# EAGLE schematic dac_ (EAGLE 9.0.1)
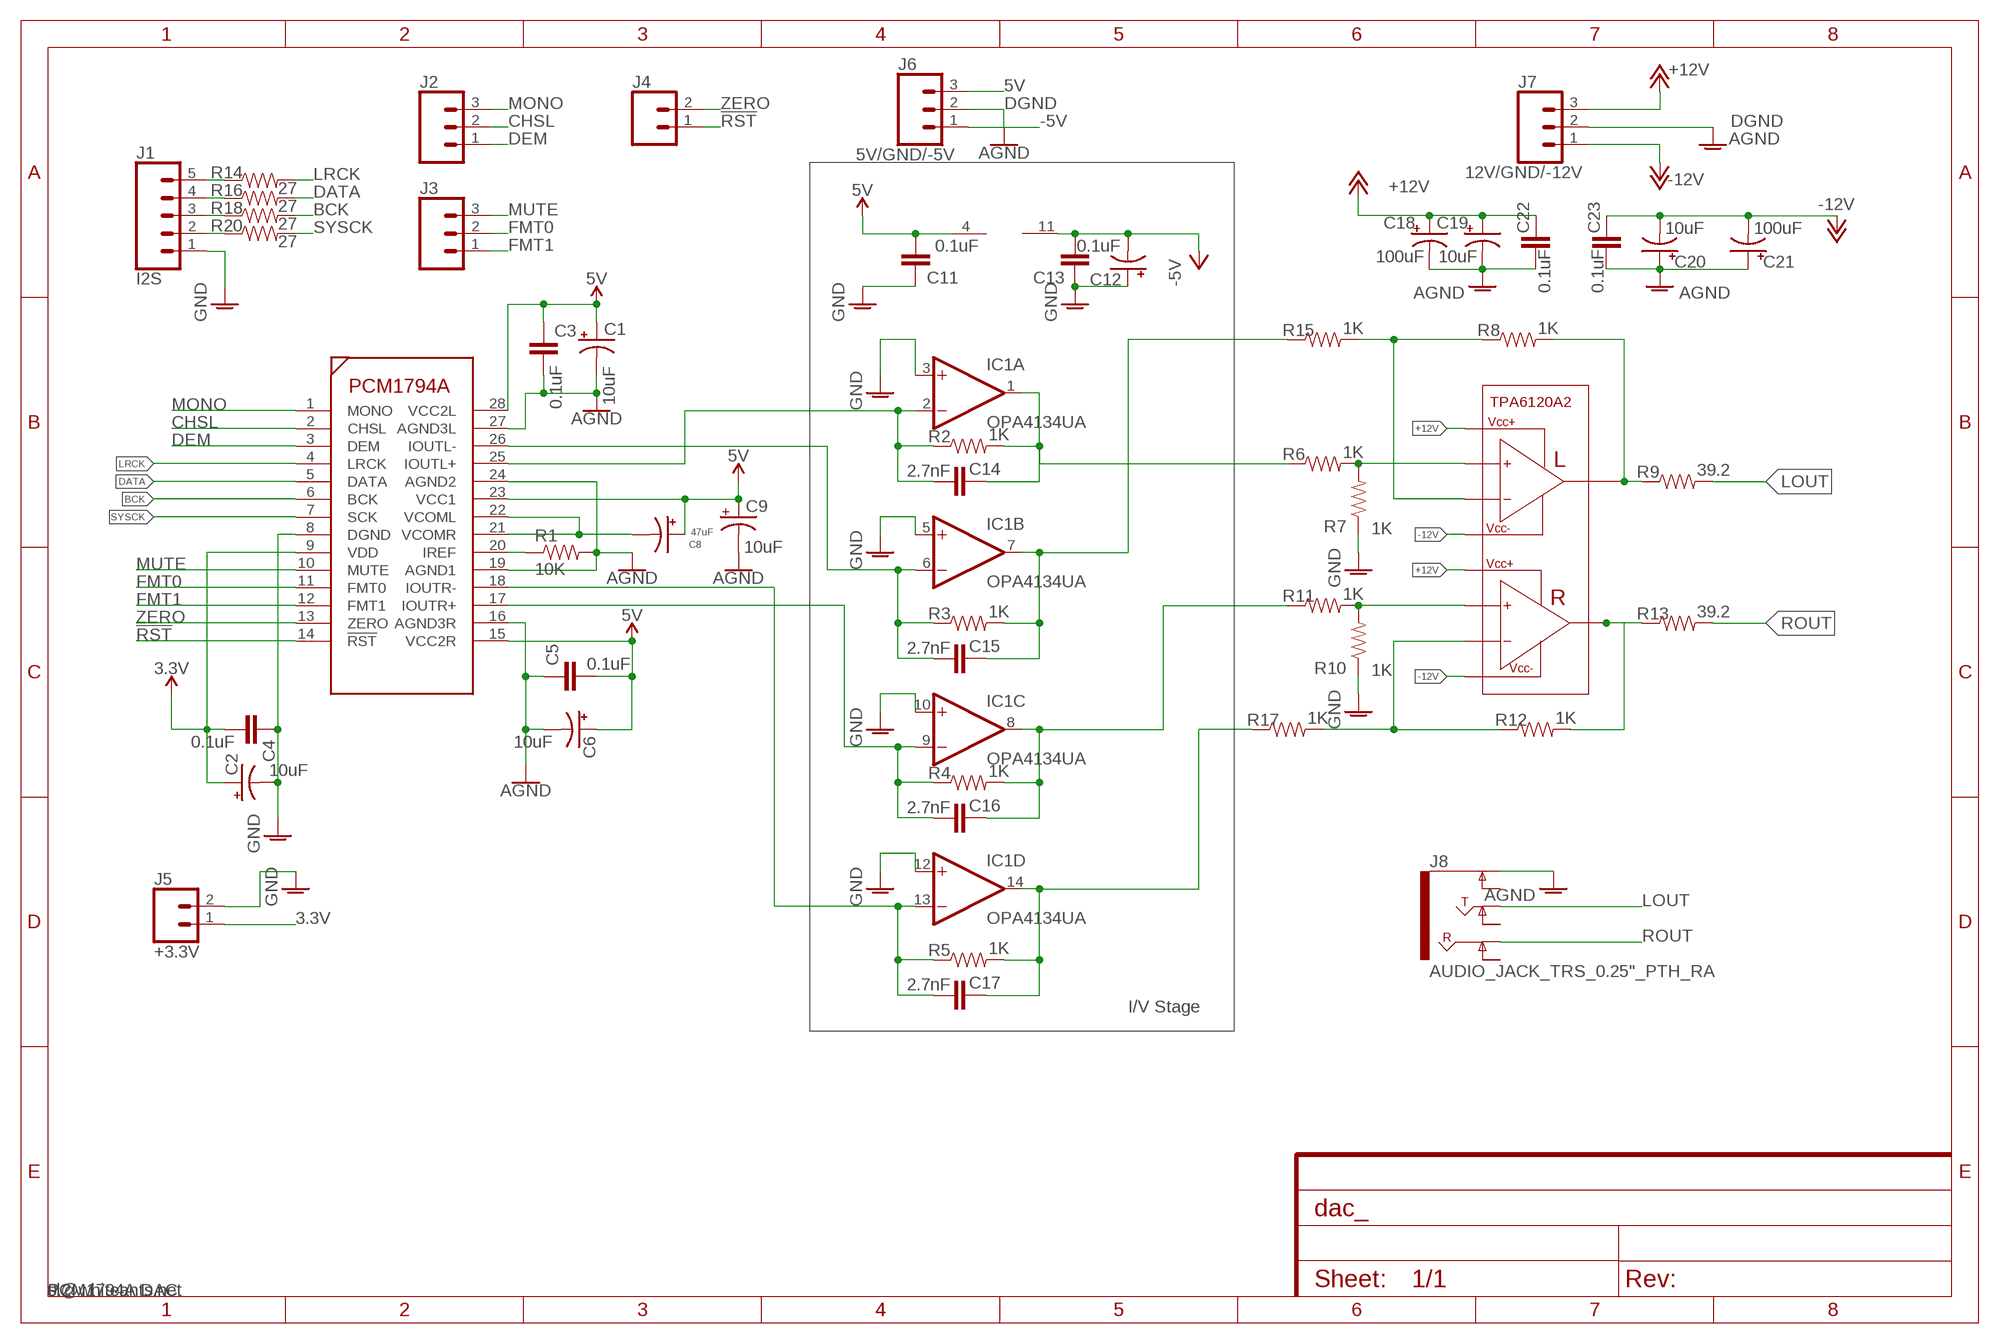
[diagram p0: schematic, sheet 1]
FRAME1 (FRAME-A4L): CNAME: PCM1794A DAC; CREVISION: 0.2; DESIGNER: sl@whiteants.net

## Parts
C1  10uF  CAP_POLPTH1  [CPOL-RADIAL-100UF-25V]
C2  10uF  CAP_POLPTH1  [CPOL-RADIAL-100UF-25V]
C3  0.1uF  CAP1206  [1206]
C4  0.1uF  CAP1206  [1206]
C5  0.1uF  CAP1206  [1206]
C6  10uF  CAP_POLPTH1  [CPOL-RADIAL-100UF-25V]
C8  47uF  CAP_POLPTH1  [CPOL-RADIAL-100UF-25V]
C9  10uF  CAP_POLPTH1  [CPOL-RADIAL-100UF-25V]
C11  0.1uF  CAP1206  [1206]
C12  10uF  CAP_POLPTH1  [CPOL-RADIAL-100UF-25V]
C13  0.1uF  CAP1206  [1206]
C14  2.7nF  CAP1206  [1206]
C15  2.7nF  CAP1206  [1206]
C16  2.7nF  CAP1206  [1206]
C17  2.7nF  CAP1206  [1206]
C18  100uF  CAP_POLPTH1  [CPOL-RADIAL-100UF-25V]
C19  10uF  CAP_POLPTH1  [CPOL-RADIAL-100UF-25V]
C20  10uF  CAP_POLPTH1  [CPOL-RADIAL-100UF-25V]
C21  100uF  CAP_POLPTH1  [CPOL-RADIAL-100UF-25V]
C22  0.1uF  CAP1206  [1206]
C23  0.1uF  CAP1206  [1206]
IC1  OPA4134UA  [SO14]
J1  I2S  CONN_05  [1X05]
J2  CONN_03POLAR  [MOLEX-1X3]
J3  CONN_03POLAR  [MOLEX-1X3]
J4  CONN_02POLAR_LOCK  [MOLEX-1X2_LOCK]
J5  +3.3V  CONN_02POLAR  [MOLEX-1X2]
J6  5V/GND/-5V  CONN_03LONGPADS  [1X03_LONGPADS]
J7  12V/GND/-12V  CONN_03LONGPADS  [1X03_LONGPADS]
J8  AUDIO_JACK_TRS_0.25"_PTH_RA  [AUDIO_JACK_0.25"_TRS_PTH_RA]
R1  10K  RESISTOR0805-RES  [0805]
R2  1K  RESISTOR0805-RES  [0805]
R3  1K  RESISTOR0805-RES  [0805]
R4  1K  RESISTOR0805-RES  [0805]
R5  1K  RESISTOR0805-RES  [0805]
R6  1K  RESISTOR0805-RES  [0805]
R7  1K  RESISTOR0805-RES  [0805]
R8  1K  RESISTOR0805-RES  [0805]
R9  39.2  RESISTOR0805-RES  [0805]
R10  1K  RESISTOR0805-RES  [0805]
R11  1K  RESISTOR0805-RES  [0805]
R12  1K  RESISTOR0805-RES  [0805]
R13  39.2  RESISTOR0805-RES  [0805]
R14  27  RESISTOR0805-RES  [0805]
R15  1K  RESISTOR0805-RES  [0805]
R16  27  RESISTOR0805-RES  [0805]
R17  1K  RESISTOR0805-RES  [0805]
R18  27  RESISTOR0805-RES  [0805]
R20  27  RESISTOR0805-RES  [0805]
UK1  PCM1794A  [SSOP28-0.65-10.2X5.2MM]
UK2  TPA6120A2  [SOIC20S]

## Nets
3.3V: C2.1(+) C4.2 J5.1 UK1.9(VDD)
5V: C1.1(+) C3.1 C5.2 C6.1(+) C8.1(+) C9.1(+) C11.2 IC1.4(P:V+) J6.3 UK1.15(VCC2R) UK1.23(VCC1) UK1.28(VCC2L)
!RST!: J4.1 UK1.14(!RST!)
+12V: C18.1(+) C19.1(+) C22.1 J7.3 UK2.3(LVCC+) UK2.18(RVCC+)
-5V: C12.2(-) C13.2 IC1.11(P:V-) J6.1
-12V: C20.2(-) C21.2(-) C23.1 J7.1 UK2.1(LVCC-) UK2.20(RVCC-)
BCK: R18.2 UK1.6(BCK)
CHSL: J2.2 UK1.2(CHSL)
DATA: R16.2 UK1.5(DATA)
DEM: J2.1 UK1.3(DEM)
DGND: C1.2(-) C2.2(-) C3.2 C4.1 C5.1 C6.2(-) C9.2(-) C11.1 C12.1(+) C13.1 C18.2(-) C19.2(-) C20.1(+) C21.1(+) C22.2 C23.2 IC1.3(A:+IN) IC1.5(B:+IN) IC1.10(C:+IN) IC1.12(D:+IN) J1.1 J5.2 J6.2 J7.2 J8.SLEEVE(EARTH) R1.2 R7.1 R10.1 UK1.8(DGND) UK1.16(AGND3R) UK1.19(AGND1) UK1.24(AGND2) UK1.27(AGND3L) ; supply symbol labelled GND, AGND
FMT0: J3.2 UK1.11(FMT0)
FMT1: J3.1 UK1.12(FMT1)
LOUT: J8.TIP R9.2
LRCK: R14.2 UK1.4(LRCK)
MONO: J2.3 UK1.1(MONO)
MUTE: J3.3 UK1.10(MUTE)
N$1: C15.2 IC1.6(B:-IN) R3.1 UK1.26(IOUTL-)
N$2: C14.2 IC1.2(A:-IN) R2.1 UK1.25(IOUTL+)
N$3: R1.1 UK1.20(IREF)
N$4: R6.2 R7.2 UK2.4(LIN+)
N$5: C14.1 IC1.1(A:OUT) R2.2 R6.1
N$6: C8.2(-) UK1.21(VCOMR) UK1.22(VCOML)
N$7: J1.5 R14.1
N$8: C15.1 IC1.7(B:OUT) R3.2 R15.1
N$9: R8.2 R9.1 UK2.2(LOUT)
N$10: R10.2 R11.2 UK2.17(RIN+)
N$11: R12.2 R13.1 UK2.19(ROUT)
N$12: C16.1 IC1.8(C:OUT) R4.2 R11.1
N$13: J1.4 R16.1
N$14: C16.2 IC1.9(C:-IN) R4.1 UK1.17(IOUTR+)
N$15: R8.1 R15.2 UK2.5(LIN-)
N$16: J1.3 R18.1
N$17: C17.2 IC1.13(D:-IN) R5.1 UK1.18(IOUTR-)
N$18: R12.1 R17.2 UK2.16(RIN-)
N$19: J1.2 R20.1
N$25: C17.1 IC1.14(D:OUT) R5.2 R17.1
ROUT: J8.RING R13.2
SYSCK: R20.2 UK1.7(SCK)
ZERO: J4.2 UK1.13(ZERO)
Unconnected: J8.RING-NORM J8.SLEEVE-NORM(EARTH-NORM) J8.TIP-NORM

## Notes on the sheet
- I/V Stage

## Library data of the parts
C1 C2 C6 C8 C9 C12 C18-C21 = SparkFun-Passives:CAP_POL: Capacitor Polarized These are standard SMD and PTH capacitors. Normally 10uF, 47uF, and 100uF in electrolytic and tantalum varieties. Always verify the external diameter of the through hole cap, it varies with capacity, voltage, and manufacturer. The EIA devices should be standard.
C3-C5 C11 C13-C17 C22 C23 = SparkFun-Passives:CAP: Capacitor Standard 0603 ceramic capacitor, and 0.1" leaded capacitor.
IC1 = linear:OPA4*: Quad Operational Amplifier compatible with: TLC27L4 Low Power, Single-Supply, Rail-To-Rail Operational Amplifier Source: http://focus.ti.com/lit/ds/symlink/opa2345.pdf http://focus.ti.com .. opa241.pdf http://focus.ti.com .. tlc27l4.pdf http://focus.ti.com/lit/ds/symlink/opa2134.pdf; SPICEPREFIX: J
J1 = SparkFun-Connectors:CONN_05: Multi connection point. Often used as Generic Header-pin footprint for 0.1 inch spaced/style header connections On any of the 0.1 inch spaced packages, you can populate with these: Break Away Headers - Straight <https://www.sparkfun.com/products/116> (PRT-00116) Break Away Male Headers - Right Angle <https://www.sparkfun.com/products/553> (PRT-00553) Female Headers <https://www.sparkfun.com/products/115> (PRT-00115) Break Away Headers - Machine Pin <https://www.sparkfun.com/products/117> (PRT-00117) Break Away Female Headers - Swiss Machine Pin <https://www.sparkfun.com/products/743> (PRT-00743) For SCREWTERMINALS and SPRING TERMINALS visit here: Screw Terimnals on SparkFun.com <https://www.sparkfun.com/search/results?term=Screw+Terminals> (5mm/3.5mm/2.54mm spacing) This device is also useful as a general connection point to wire up your design to another part of your project. Our various solder wires solder well into these plated through hole pads. Hook-Up Wire - Assortment (Stranded, 22 AWG) <https://www.sparkfun.com/products/11375> (PRT-11375) Hook-Up Wire - Assortment (Solid Core, 22 AWG) <https://www.sparkfun.com/products/11367> (PRT-11367) View the entire wire category on our website here <https://www.sparkfun.com/categories/141> Special notes: Molex polarized connector foot print use with SKU : PRT-08231 with associated crimp pins and housings. 1MM SMD Version SKU: PRT-10208
J2 J3 = SparkFun-Connectors:CONN_03: Multi connection point. Often used as Generic Header-pin footprint for 0.1 inch spaced/style header connections On any of the 0.1 inch spaced packages, you can populate with these: Break Away Headers - Straight <https://www.sparkfun.com/products/116> (PRT-00116) Break Away Male Headers - Right Angle <https://www.sparkfun.com/products/553> (PRT-00553) Female Headers <https://www.sparkfun.com/products/115> (PRT-00115) Break Away Headers - Machine Pin <https://www.sparkfun.com/products/117> (PRT-00117) Break Away Female Headers - Swiss Machine Pin <https://www.sparkfun.com/products/743> (PRT-00743) Stackable Header - 3 Pin (Female, 0.1") <https://www.sparkfun.com/products/13875> (PRT-13875) For SCREWTERMINALS and SPRING TERMINALS visit here: Screw Terimnals on SparkFun.com <https://www.sparkfun.com/search/results?term=Screw+Terminals> (5mm/3.5mm/2.54mm spacing) This device is also useful as a general connection point to wire up your design to another part of your project. Our various solder wires solder well into these plated through hole pads. Hook-Up Wire - Assortment (Stranded, 22 AWG) <https://www.sparkfun.com/products/11375> (PRT-11375) Hook-Up Wire - Assortment (Solid Core, 22 AWG) <https://www.sparkfun.com/products/11367> (PRT-11367) View the entire wire category on our website here <https://www.sparkfun.com/categories/141> Special notes: Molex polarized connector foot print use with SKU : PRT-08232 with associated crimp pins and housings.; PROD_ID: CONN-08625; SF_ID: PRT-08096
J4 J5 = SparkFun-Connectors:CONN_02: Multi connection point. Often used as Generic Header-pin footprint for 0.1 inch spaced/style header connections On any of the 0.1 inch spaced packages, you can populate with these: Break Away Headers - Straight <https://www.sparkfun.com/products/116> (PRT-00116) Break Away Male Headers - Right Angle <https://www.sparkfun.com/products/553> (PRT-00553) Female Headers <https://www.sparkfun.com/products/115> (PRT-00115) Break Away Headers - Machine Pin <https://www.sparkfun.com/products/117> (PRT-00117) Break Away Female Headers - Swiss Machine Pin <https://www.sparkfun.com/products/743> (PRT-00743) For SCREWTERMINALS and SPRING TERMINALS visit here: Screw Terimnals on SparkFun.com <https://www.sparkfun.com/search/results?term=Screw+Terminals> (5mm/3.5mm/2.54mm spacing) This device is also useful as a general connection point to wire up your design to another part of your project. Our various solder wires solder well into these plated through hole pads. Hook-Up Wire - Assortment (Stranded, 22 AWG) <https://www.sparkfun.com/products/11375> (PRT-11375) Hook-Up Wire - Assortment (Solid Core, 22 AWG) <https://www.sparkfun.com/products/11367> (PRT-11367) View the entire wire category on our website here <https://www.sparkfun.com/categories/141> Special notes: Molex polarized connector foot print use with: PRT-08233 with associated crimp pins and housings. 2.54_SCREWTERM for use with PRT-10571. 3.5mm Screw Terminal footprints for PRT-08084 5mm Screw Terminal footprints for use with PRT-08432; SF_ID: PRT-09918
J6 J7 = SparkFun-Connectors:CONN_03: Multi connection point. Often used as Generic Header-pin footprint for 0.1 inch spaced/style header connections On any of the 0.1 inch spaced packages, you can populate with these: Break Away Headers - Straight <https://www.sparkfun.com/products/116> (PRT-00116) Break Away Male Headers - Right Angle <https://www.sparkfun.com/products/553> (PRT-00553) Female Headers <https://www.sparkfun.com/products/115> (PRT-00115) Break Away Headers - Machine Pin <https://www.sparkfun.com/products/117> (PRT-00117) Break Away Female Headers - Swiss Machine Pin <https://www.sparkfun.com/products/743> (PRT-00743) Stackable Header - 3 Pin (Female, 0.1") <https://www.sparkfun.com/products/13875> (PRT-13875) For SCREWTERMINALS and SPRING TERMINALS visit here: Screw Terimnals on SparkFun.com <https://www.sparkfun.com/search/results?term=Screw+Terminals> (5mm/3.5mm/2.54mm spacing) This device is also useful as a general connection point to wire up your design to another part of your project. Our various solder wires solder well into these plated through hole pads. Hook-Up Wire - Assortment (Stranded, 22 AWG) <https://www.sparkfun.com/products/11375> (PRT-11375) Hook-Up Wire - Assortment (Solid Core, 22 AWG) <https://www.sparkfun.com/products/11367> (PRT-11367) View the entire wire category on our website here <https://www.sparkfun.com/categories/141> Special notes: Molex polarized connector foot print use with SKU : PRT-08232 with associated crimp pins and housings.
J8 = SparkFun-Connectors:AUDIO_JACK_TRS_0.25"_PTH_RA: Audio Jack, 1/4" TRS jack, horizontal, PTH, aka "Phono jack" Find the connector here: Audio Jack - 1/4" Stereo (right angle) <https://www.sparkfun.com/products/11144> (COM-11144) Datasheet <http://cdn.sparkfun.com/datasheets/Components/General/JP-611%20DD.jpg> Note, although the datasheet and physical part are slightly different, this footprint was proven to mate well on the Proto Pedal. This device is used on these SparkFun Products: SparkFun TRS Jack Breakout - 1/4" Stereo <https://www.sparkfun.com/products/13005> (BOB-13005 ) SparkFun Proto Pedal - sorry bad link - product comming soon! <https://www.sparkfun.com/products/13124> (PRT-13124); PROD_ID: CONN-12339; SF_ID: COM-11144
R1-R18 R20 = SparkFun-Passives:RESISTOR: Resistor Basic schematic elements and footprints for 0603, 1206, and PTH resistors.
UK1 = EduAreaLib:PCM1794A: The PCM1794A device is a monolithic, CMOS-integrated circuit that includes stereo digital-to-analog converters (DACs) and support circuitry in a small 28-pin SSOP package. The data converters use TI’s advanced segment DAC architecture to achieve excellent dynamic performance and improved tolerance to clock jitter. The PCM1794A device provides balanced current outputs, allowing the user to optimize analog performance externally. Sampling rates up to 200 kHz are supported.
UK2 = EduAreaLib:TPA6120A2: TPA6120A2 High Fidelity Headphone Amplifier